# EAGLE design OpenAir (EAGLE 7.6.0)
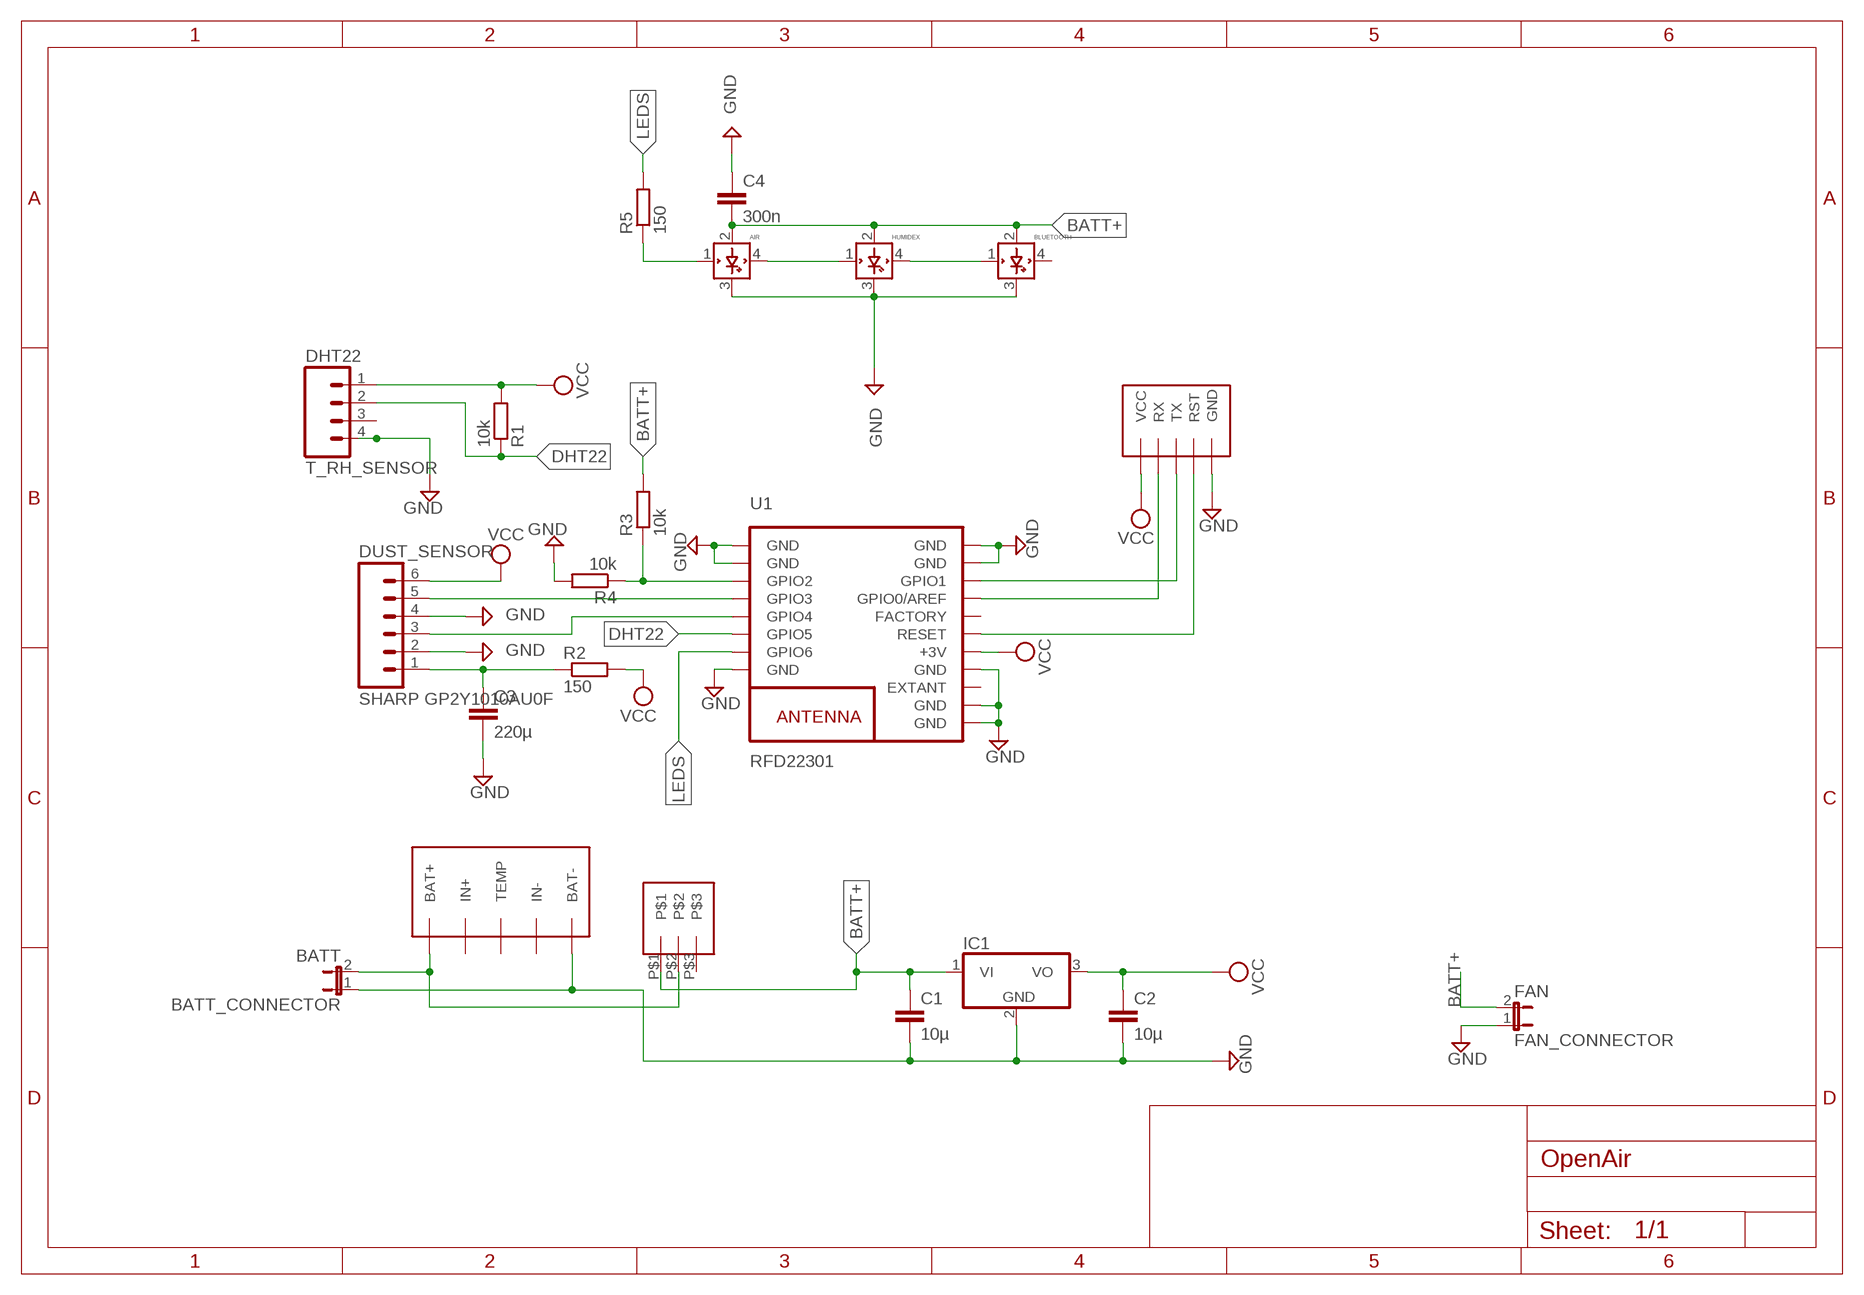
[diagram p0: schematic, sheet 1]

## Parts
AIR  WS2812BRGB  [LED5MMRGB]
BATT_CONNECTOR  BATT  JP1E  [JP1]
BLUETOOTH  WS2812BRGB  [LED5MMRGB]
C1  10µ  C-EU025-030X050  [C025-030X050]
C2  10µ  C-EU025-030X050  [C025-030X050]
C3  220µ  C-EU025-030X050  [C025-030X050]
C4  300n  C-EU025-030X050  [C025-030X050]
DUST_SENSOR  SHARP GP2Y1010AU0F  M06LONGPADS  [1X06_LONGPADS]
FAN_CONNECTOR  FAN  JP1E  [JP1]
HUMIDEX  WS2812BRGB  [LED5MMRGB]
IC1  78T  7805T  [TO220H]
R1  10k  R-EU_0207/10  [0207/10]
R2  150  R-EU_0207/10  [0207/10]
R3  10k  R-EU_0207/10  [0207/10]
R4  10k  R-EU_0207/10  [0207/10]
R5  150  R-EU_0207/10  [0207/10]
T_RH_SENSOR  DHT22  M04JST-PTH-VERT  [JST-4-PTH-VERT]
U1  RFD22301  [RFD22301]
U$1  IC_PROG  [IC_PROG]
U$4  BATT_CHARG  [BATT_CHARG]
U$5  SPSTCUSTOM  [SPSTCUSTOM]

## Nets
BATT+: AIR.2(VDD) BLUETOOTH.2(VDD) C1.1 C4.2 FAN_CONNECTOR.2 HUMIDEX.2(VDD) IC1.1(VI) R3.2 U$5.P$1
DHT22: R1.1 T_RH_SENSOR.2 U1.6(GPIO5)
GND: AIR.3(GND) BATT_CONNECTOR.1 BLUETOOTH.3(GND) C1.2 C2.2 C3.2 C4.1 DUST_SENSOR.2 DUST_SENSOR.4 FAN_CONNECTOR.1 HUMIDEX.3(GND) IC1.2(GND) R4.2 T_RH_SENSOR.4 U1.1(GND) U1.2(GND) U1.8(GND) U1.9(GND) U1.10(GND) U1.12(GND) U1.18(GND) U1.19(GND) U$1.GND U$4.BAT-
LEDS: R5.2 U1.7(GPIO6)
N$1: AIR.4(DOUT) HUMIDEX.1(DIN)
N$2: U1.14(RESET) U$1.RST
N$3: BLUETOOTH.1(DIN) HUMIDEX.4(DOUT)
N$4: U1.16(GPIO0/AREF) U$1.RX
N$5: U1.17(GPIO1) U$1.TX
N$6: DUST_SENSOR.5 U1.4(GPIO3)
N$7: DUST_SENSOR.3 U1.5(GPIO4)
N$8: C3.1 DUST_SENSOR.1 R2.1
N$9: R3.1 R4.1 U1.3(GPIO2)
N$10: BATT_CONNECTOR.2 U$4.BAT+ U$5.P$2
N$12: AIR.1(DIN) R5.1
VCC: C2.1 DUST_SENSOR.6 IC1.3(VO) R1.2 R2.2 T_RH_SENSOR.1 U1.13(+3V) U$1.VCC
Unconnected: BLUETOOTH.4(DOUT) T_RH_SENSOR.3 U1.11(EXTANT) U1.15(FACTORY) U$4.IN+ U$4.IN- U$4.TEMP U$5.P$3

## Library data of the parts
AIR BLUETOOTH HUMIDEX = adafruit:WS2812B
BATT_CONNECTOR FAN_CONNECTOR = jumper:JP1E: JUMPER
C1-C4 = rcl:C-EU: CAPACITOR, European symbol
DUST_SENSOR = SparkFun-Connectors:M06: Header 6 Standard 6-pin 0.1" header. Use with straight break away headers (SKU : PRT-00116), right angle break away headers (PRT-00553), swiss pins (PRT-00743), machine pins (PRT-00117), and female headers (PRT-00115). Molex polarized connector foot print use with SKU : PRT-08094 with associated crimp pins and housings. NOTES ON THE VARIANTS LOCK and LOCK_LONGPADS... This footprint was designed to help hold the alignment of a through-hole component (i.e. 6-pin header) while soldering it into place. You may notice that each hole has been shifted either up or down by 0.005 of an inch from it's more standard position (which is a perfectly straight line). This slight alteration caused the pins (the squares in the middle) to touch the edges of the holes. Because they are alternating, it causes a "brace" to hold the component in place. 0.005 has proven to be the perfect amount of "off-center" position when using our standard breakaway headers. Although looks a little odd when you look at the bare footprint, once you have a header in there, the alteration is very hard to notice. Also,if you push a header all the way into place, it is covered up entirely on the bottom side. This idea of altering the position of holes to aid alignment will be further integrated into the Sparkfun Library for other footprints. It can help hold any component with 3 or more connection pins.
IC1 = adafruit:78*: Positive VOLTAGE REGULATOR Added bigger pads to the TO-92 package
R1-R5 = rcl:R-EU_: RESISTOR, European symbol
T_RH_SENSOR = SparkFun-Connectors:M04: Header 4 Standard 4-pin 0.1" header. Use with straight break away headers (SKU : PRT-00116), right angle break away headers (PRT-00553), swiss pins (PRT-00743), machine pins (PRT-00117), and female headers (PRT-00115). Molex polarized connector foot print use with SKU : PRT-08231 with associated crimp pins and housings. 1MM SMD Version SKU: PRT-10208; PROD_ID: CONN-13251
U1 = RF_Digital_RFD22301_Eagle_Schematic_PCB_Library:RFD22301: RFD22301 RFduino SMT Module RFD22301 Datasheet: http://www.rfdigital.com/wp-content/uploads/2014/03/RFD22301.Data_.Sheet_.11.24.13_11.38PM.pdf
U$1 = PMClab_utils:IC_PROG
U$4 = PMClab_utils:BATT_CHARG
U$5 = SPSTCUSTOM:SPSTCUSTOM

## Board
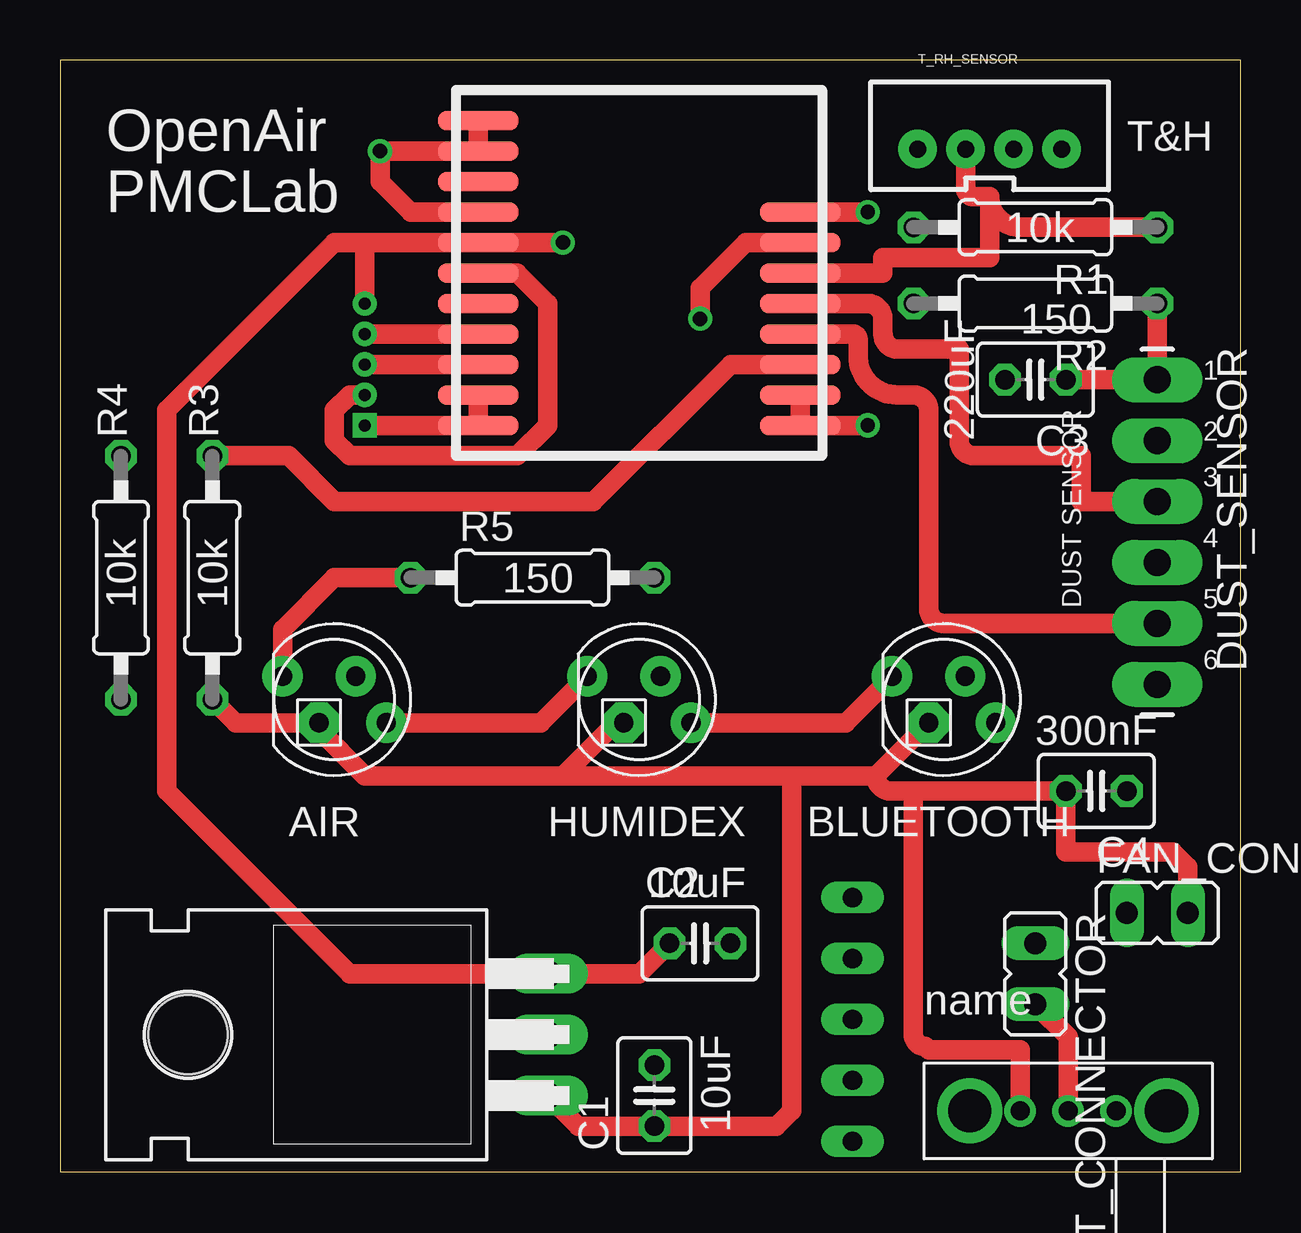
[diagram p1: board, top side]
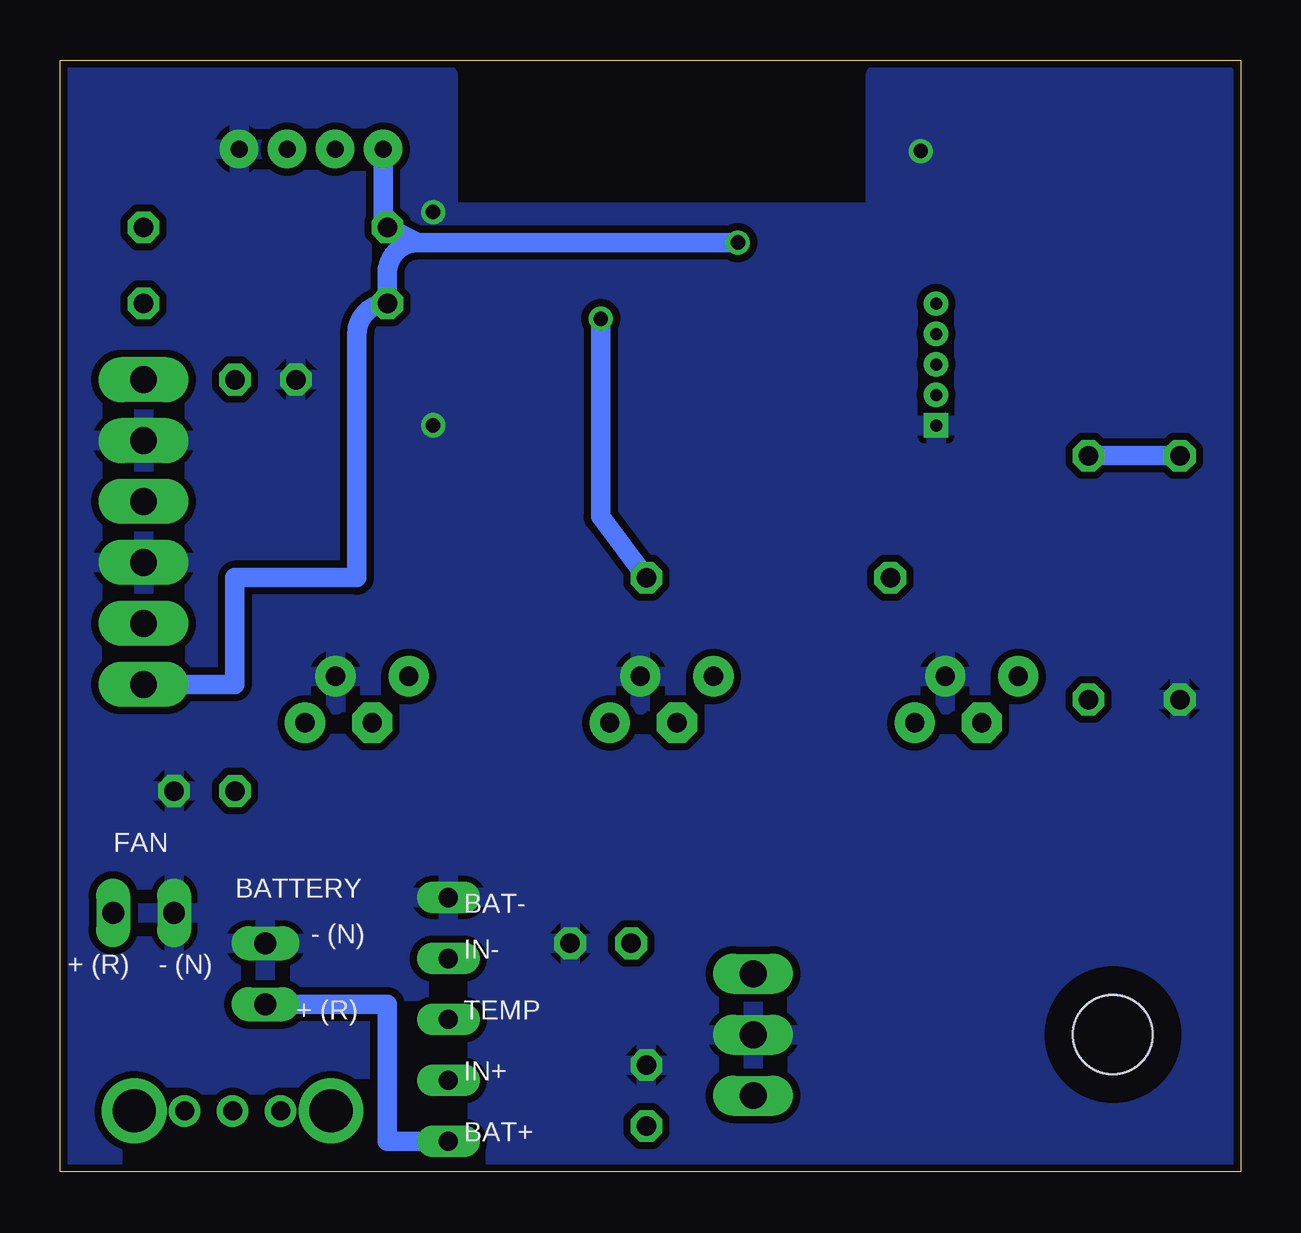
[diagram p2: board, bottom side, seen from below]

Size 49.2 x 46.34 mm. Coordinates in mm from the lower left corner, seen from the top.
Outline: 0,0 49.2,0 49.2,46.34 0,46.34 0,0
Copper layers (1*16): Top 0.035mm / dielectric 1.5mm / Bottom 0.035mm
Design rules "default *": minimum track width 6mil, minimum drill 12mil, track to track 6mil, track to pad 6mil, pad to pad 6mil, via to via 6mil, smd to smd 6mil, copper to edge 8mil, drill to drill 6mil, minimum pad ring 10mil, minimum via ring 8mil, stop-mask expansion 4mil, vias tented up to drill 0mil, thermal gap 10mil

### Footprints (pad centres in the part's own frame; a part is rotated, then mirrored left to right if it is on the bottom)
LED5MMRGB = drill 0.8 pad 1.676: 1 -2.159,0.968; 3 0.889,0.968; 4 2.159,-0.968 | drill 0.8 pad 1.676 octagon: 2 -0.635,-0.968
JP1 = drill 0.914 long: 1 0,-1.27; 2 0,1.27
C025-030X050 = drill 0.813 octagon: 1 -1.27,0; 2 1.27,0
1X06_LONGPADS = drill 1.118 pad 1.88 long: 1 0,0; 2 2.54,0; 3 5.08,0; 4 7.62,0; 5 10.16,0; 6 12.7,0
TO220H = drill 1.118 long: 1 -2.54,-10.16; 2 0,-10.16; 3 2.54,-10.16 | hole 3.302: 0,4.826
0207/10 = drill 0.813 octagon: 1 -5.08,0; 2 5.08,0
JST-4-PTH-VERT = drill 0.7 pad 1.6: 1 -3,-0.55; 2 -1,-0.55; 3 1,-0.55; 4 3,-0.55
RFD22301 = smd 3.353 x 0.813: 1 -6.706,7.62; 2 -6.706,6.35; 3 -6.706,5.08; 4 -6.706,3.81; 5 -6.706,2.54; 6 -6.706,1.27; 7 -6.706,0; 8 -6.706,-1.27; 9 6.706,-5.08; 10 6.706,-3.81; 11 6.706,-2.54; 12 6.706,-1.27; 13 6.706,0; 14 6.706,1.27; 15 6.706,2.54; 16 6.706,3.81; 17 6.706,5.08; 18 6.706,6.35; 19 6.706,7.62
IC_PROG = drill 0.5 square: GND 0,-2.54 | drill 0.5: RST 0,-1.27; RX 0,1.27; TX 0,0; VCC 0,2.54
BATT_CHARG = drill 0.8 long: BAT+ 0,5.08; BAT- 0,-5.08; IN+ 0,2.54; IN- 0,-2.54; TEMP 0,0
SPSTCUSTOM = drill 0.8: P$1 0,0; P$2 2,0; P$3 4,0 | drill 1.8: P$4 6.1,0; P$5 -2.1,0

### Placement (x,y rotation side)
AIR  11.43,19.68 0 top
BATT_CONNECTOR  40.64,8.26 180 top
BLUETOOTH  36.83,19.68 0 top
C1  24.77,3.17 90 top
C2  26.67,9.53 0 top
C3  40.64,33.02 180 top
C4  43.18,15.88 180 top
DUST_SENSOR  45.72,33.02 270 top
FAN_CONNECTOR  45.72,10.79 270 top
HUMIDEX  24.13,19.68 0 top
IC1  10.16,5.71 90 top
R1  40.64,39.37 180 top
R2  40.64,36.2 180 top
R3  6.35,24.76 270 top
R4  2.54,24.76 270 top
R5  19.68,24.76 0 top
T_RH_SENSOR  38.73,43.18 0 top
U1  24.13,38.73 180 top
U$1  12.7,33.66 0 top
U$4  33.02,6.35 180 top
U$5  40.01,2.54 0 top

### Tracks (layer width: path | path; a pad name or v marks a point on that pad's centre or on a via)
BATT+
  Top 0.813: IC1.1 21.59,1.91 C1.1 29.84,1.91 30.48,2.54 30.48,16.51 | 20.95,16.51 12.7,16.51 10.79,18.41 AIR.2 7.32,18.72 R3.2 | 20.95,16.51 30.48,16.51 | 30.48,16.51 33.99,16.51 | 33.99,16.51 BLUETOOTH.2 | HUMIDEX.2 23.16,18.72 20.95,16.51 | U$5.P$1 40.01,5.08 36.2,5.08 36.04,5.23 arc-90 35.56,5.71 35.56,15.88 | 33.99,16.51 arc90 34.62,15.88 35.56,15.88 | 35.56,15.88 C4.2 41.91,13.34 46.35,13.34 46.99,12.7 FAN_CONNECTOR.2
DHT22
  Top 0.813: U1.6 34.29,37.47 34.29,38.1 38.73,38.1 38.73,40.64 | 38.73,40.64 38.1,40.64 arc-90 37.73,41.01 T_RH_SENSOR.2 | 38.73,40.64 arc90 40.01,39.37 R1.1
GND  (via drill 0.6)
  Top 0.813: U$1.GND U1.19 U1.18 | U1.9 U1.10 v13.34,42.55 13.34,41.27 14.61,40.01 U1.12 | U1.2 U1.1 v33.66,31.11 | v33.66,40.01 U1.8
  pour Bottom (isolate 0.305): 0.64,45.72 15.24,45.72 15.24,40.01 33.02,40.01 33.02,45.72 48.9,45.72 48.9,0 0.64,0
LEDS  (via drill 0.6)
  Top 0.813: U1.7 28.57,38.73 26.67,36.83 v26.67,35.56
  Bottom 0.813: v26.67,35.56 26.67,27.3 R5.2
N$1
  Top 0.813: AIR.4 20.03,18.72 HUMIDEX.1
N$2
  Top 0.813: U$1.RST 12.06,32.39 11.43,31.75 11.43,30.48 12.06,29.84 19.05,29.84 20.32,31.11 20.32,36.2 19.05,37.47 U1.14
N$3
  Top 0.813: HUMIDEX.4 32.73,18.72 BLUETOOTH.1
N$4
  Top 0.813: U$1.RX U1.16
N$5
  Top 0.813: U$1.TX U1.17
N$6
  Top 0.813: U1.4 33.02,34.93 arc-90 33.25,34.7 33.25,34.02 arc90 34.88,32.39 35.56,32.39 arc-90 36.2,31.75 36.2,23.49 arc90 36.83,22.86 DUST_SENSOR.5
N$7
  Top 0.813: U1.5 33.66,36.2 arc-90 34.29,35.56 34.29,34.93 arc90 34.92,34.29 37.47,34.29 37.47,30.48 arc90 38.1,29.84 42.55,29.84 42.55,27.94 DUST_SENSOR.3
N$8
  Top 0.813: C3.1 DUST_SENSOR.1 R2.1
N$9
  Top 0.813: R3.1 9.53,29.84 11.43,27.94 22.23,27.94 27.94,33.66 U1.3
  Bottom 0.813: R4.1 R3.1
N$10
  Top 0.813: 40.73,6.89 arc90 BATT_CONNECTOR.2 42.01,5.62 U$5.P$2
  Bottom 0.813: U$4.BAT+ 35.56,1.27 35.56,6.99 BATT_CONNECTOR.2
N$12
  Top 0.813: AIR.1 9.27,22.61 11.43,24.76 R5.1
VCC  (via drill 0.6)
  Top 0.813: C2.1 24.13,8.26 IC1.3 12.06,8.26 4.45,15.88 4.45,31.75 11.43,38.73 12.7,38.73 | 12.7,38.73 U1.13 v20.95,38.73 | U$1.VCC 12.7,38.73
  Bottom 0.813: v20.95,38.73 34.29,38.73 | 34.29,38.73 R1.2 35.73,39.55 T_RH_SENSOR.1 | 34.29,38.73 arc-90 35.56,37.47 R2.2 arc-90 36.83,34.93 36.83,24.76 41.91,24.76 41.91,20.32 DUST_SENSOR.6

### Text on the board
tPlace: OpenAir | T&H | PMCLab | 10k | 150 | 1 | 220uF | 2 | 3 | 4 | 150 | 10k | 10k | DUST SENSOR | 5 | 6 | 300nF | 10uF | 10uF
bPlace: FAN | BATTERY | BAT- | IN- | - (N) | - (N) | + (R) | TEMP | + (R) | IN+ | BAT+